# EAGLE schematic OOBD-TigerV2_old (EAGLE 7.2.0)

## Sheet 1 of 5
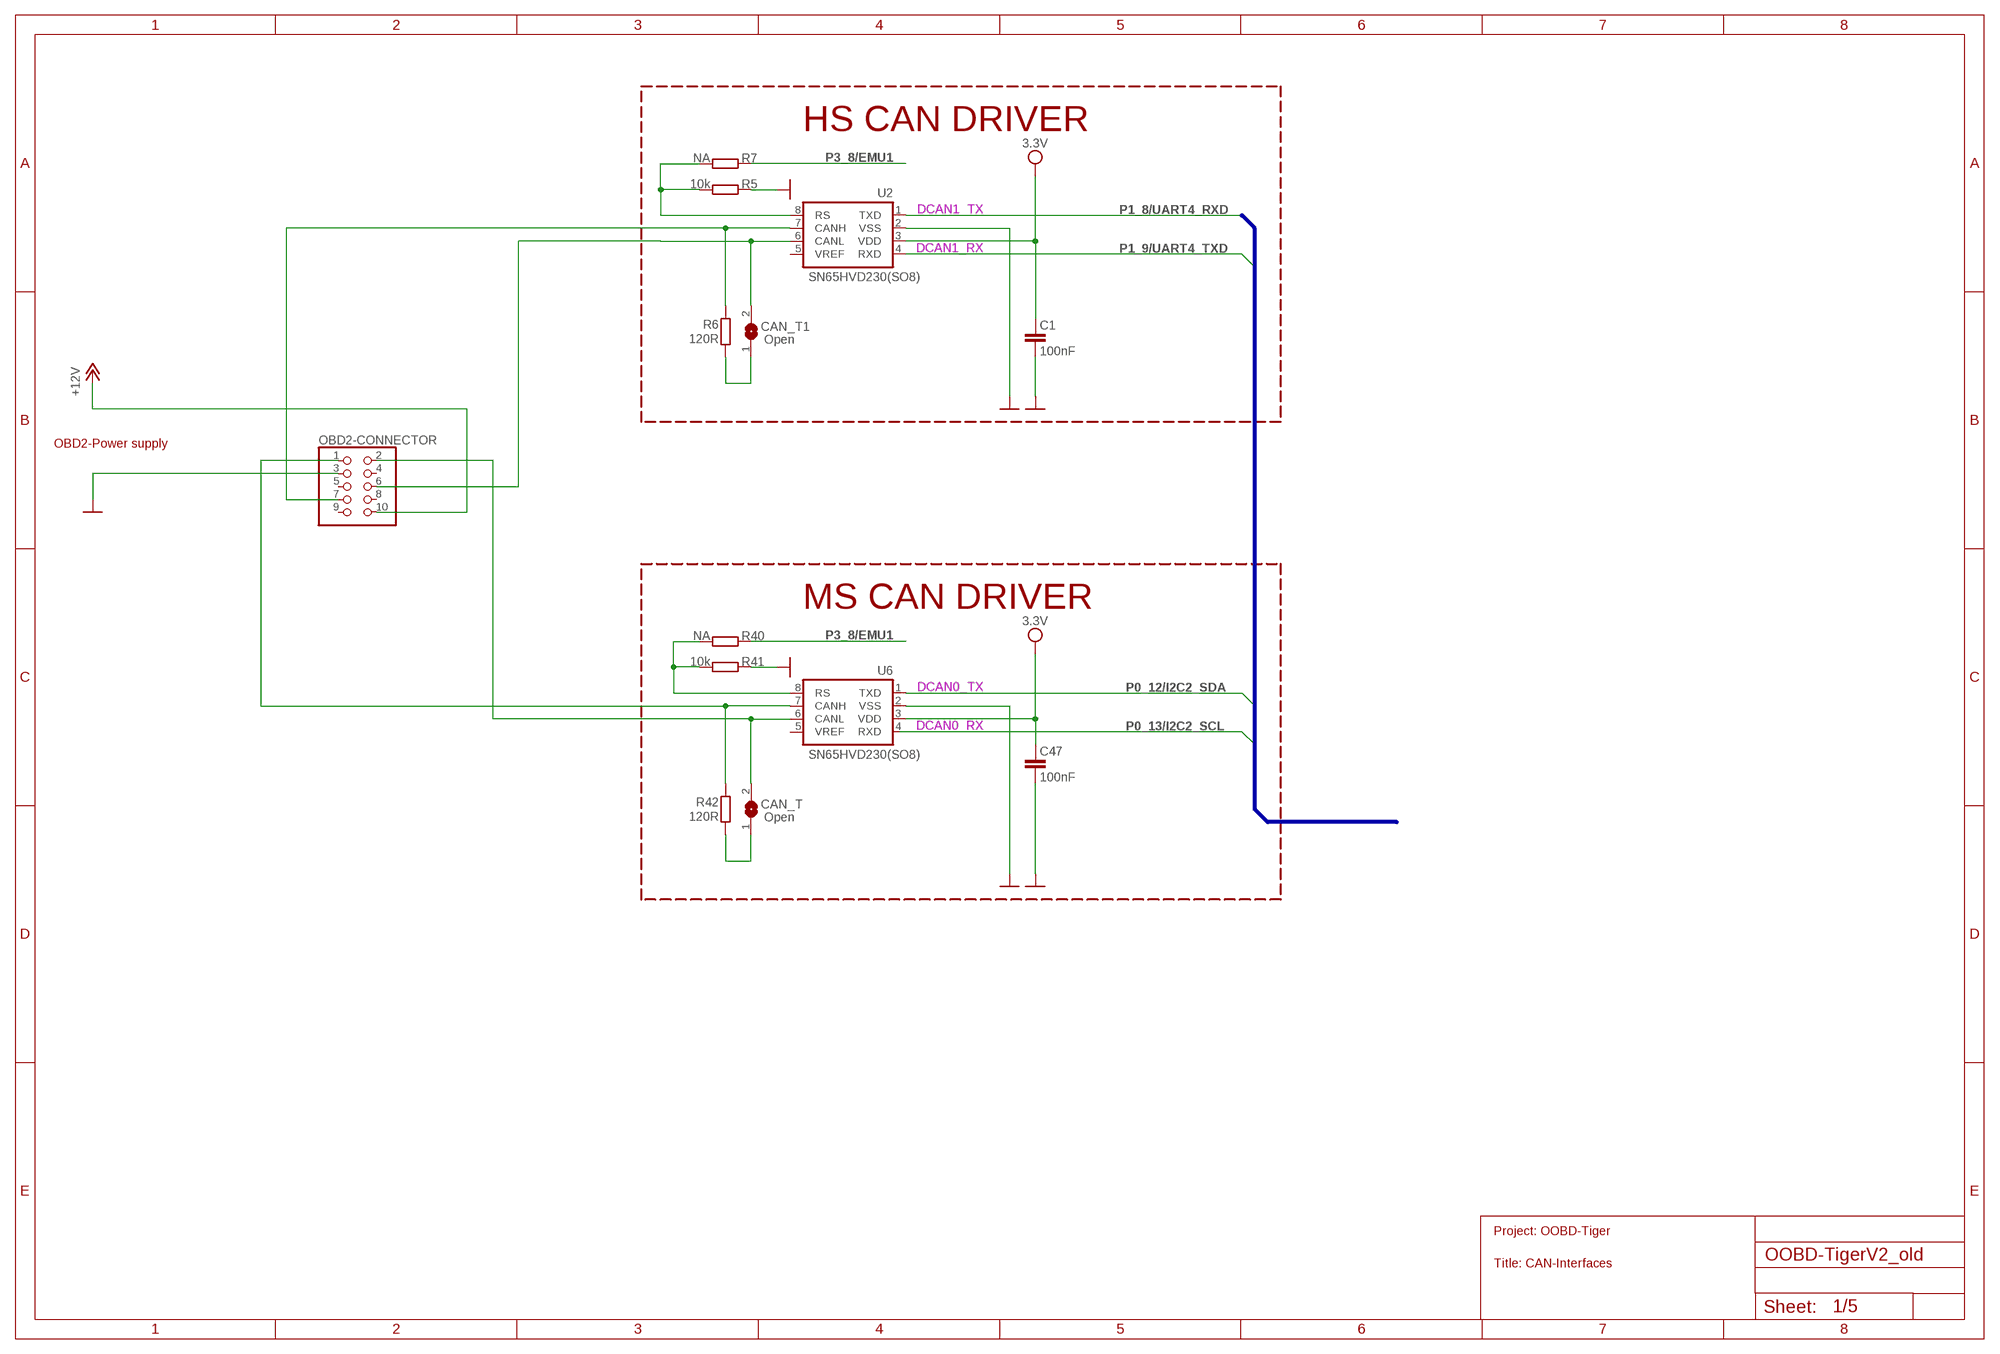
[diagram p0: schematic, sheet 1]

### Parts
C1  100nF  C-EUC0603_DWS  [C0603_DWS]
C47  100nF  C-EUC0603_DWS  [C0603_DWS]
CAN_T  Open  SJSJ_SMALLER  [SJ_1_SMALLER]
CAN_T1  Open  SJSJ_SMALLER  [SJ_1_SMALLER]
OBD2-CONNECTOR  PINHD-2X5/90  [2X05/90]
R5  10k  R-EU_R0603_5MIL_DWS  [R0603_5MIL_DWS]
R6  120R  R-EU_R1206_5MIL_WS  [R1206_5MIL_WS]
R7  NA  R-EU_R0603_5MIL_DWS  [R0603_5MIL_DWS]
R40  NA  R-EU_R0603_5MIL_DWS  [R0603_5MIL_DWS]
R41  10k  R-EU_R0603_5MIL_DWS  [R0603_5MIL_DWS]
R42  120R  R-EU_R1206_5MIL_WS  [R1206_5MIL_WS]
U2  SN65HVD230(SO8)  MCP2551  [SO-08]
U6  SN65HVD230(SO8)  MCP2551  [SO-08]

### Nets
+12V: OBD2-CONNECTOR.10 ; also sheet 5
CANH: OBD2-CONNECTOR.1 R42.2 U6.7(CANH)
CANH1: OBD2-CONNECTOR.7 R6.2 U2.7(CANH)
CANL: CAN_T.2 OBD2-CONNECTOR.2 U6.6(CANL)
CANL1: CAN_T1.2 OBD2-CONNECTOR.6 U2.6(CANL)
GND [PWR]: C1.2 C47.2 OBD2-CONNECTOR.3 R5.2 R41.2 U2.2(VSS) U6.2(VSS) ; also sheet 2,4,5
N$2: CAN_T1.1 R6.1
N$5: R5.1 R7.1 U2.8(RS)
N$80: R40.1 R41.1 U6.8(RS)
N$566: CAN_T.1 R42.1
P0_12/I2C2_SDA: U6.1(TXD) ; also sheet 4
P0_13/I2C2_SCL: U6.4(RXD) ; also sheet 4
P1_8/UART4_RXD: U2.1(TXD) ; also sheet 4
P1_9/UART4_TXD: U2.4(RXD) ; also sheet 4
P3_8/EMU1: R7.2 R40.2 ; also sheet 4
VCC [PWR]: C1.1 C47.1 U2.3(VDD) U6.3(VDD) ; supply symbol labelled 3.3V ; also sheet 4,5
Unconnected: OBD2-CONNECTOR.4 OBD2-CONNECTOR.5 OBD2-CONNECTOR.8 OBD2-CONNECTOR.9 U2.5(VREF) U6.5(VREF)

### Buses
B$2

### Notes on the sheet
- HS CAN DRIVER
- DCAN1_TX
- DCAN1_RX
- OBD2-Power supply
- MS CAN DRIVER
- DCAN0_TX
- DCAN0_RX
- Project: OOBD-Tiger
- Title: CAN-Interfaces

## Sheet 2 of 5
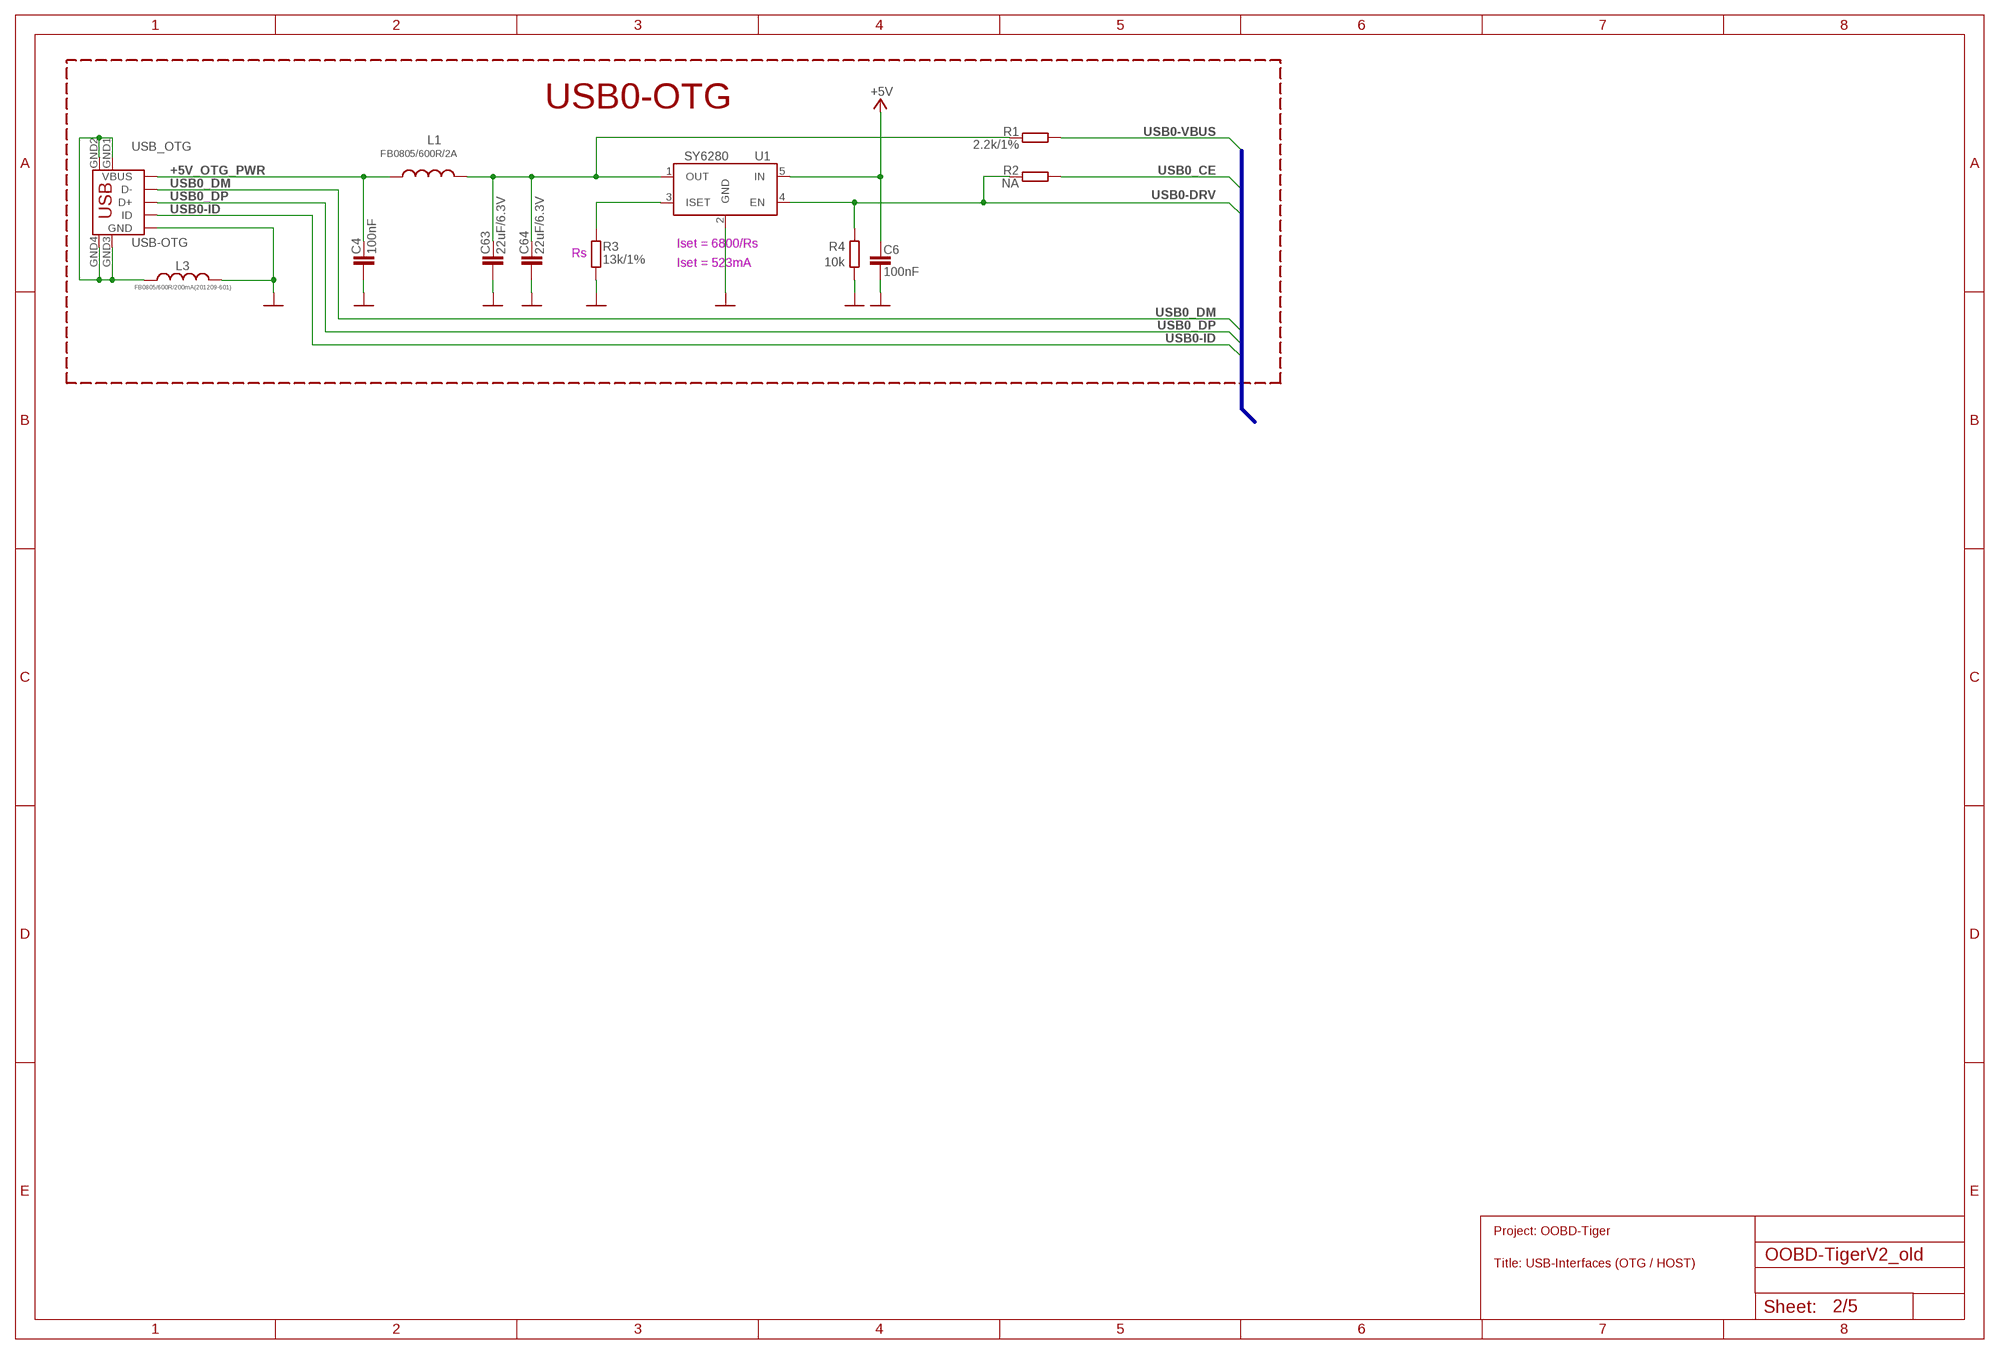
[diagram p1: schematic, sheet 2]

### Parts
C4  100nF  C-EUC0603_DWS  [C0603_DWS]
C6  100nF  C-EUC0603_DWS  [C0603_DWS]
C63  22uF/6.3V  C-EUC0603_DWS  [C0603_DWS]
C64  22uF/6.3V  C-EUC0603_DWS  [C0603_DWS]
L1  FB0805/600R/2A  L-USL0805_5MIL_DWS  [L0805_5MIL_DWS]
L3  FB0805/600R/200mA(201209-601)  L-USL0805_5MIL_DWS  [L0805_5MIL_DWS]
R1  2.2k/1%  R-EU_R0603_5MIL_DWS  [R0603_5MIL_DWS]
R2  NA  R-EU_R0603_5MIL_DWS  [R0603_5MIL_DWS]
R3  13k/1%  R-EU_R0603_5MIL_DWS  [R0603_5MIL_DWS]
R4  10k  R-EU_R0603_5MIL_DWS  [R0603_5MIL_DWS]
U1  SY6280  [SOT23-5]
USB_OTG  USB-OTG  MINI_USB9  [USB_MINI_9PIN]

### Nets
+5V: C6.1 U1.5(IN) ; also sheet 3,4,5
+5V_OTG_PWR: C4.1 L1.1 USB_OTG.VBUS
GND [PWR]: C4.2 C6.2 C63.2 C64.2 L3.1 R3.1 R4.1 U1.2(GND) USB_OTG.GND ; also sheet 1,4,5
N$99: R3.2 U1.3(ISET)
N$100: C63.1 C64.1 L1.2 R1.2 U1.1(OUT)
N$266: L3.2 USB_OTG.GND1 USB_OTG.GND2 USB_OTG.GND3 USB_OTG.GND4
USB0-DRV: R2.1 R4.2 U1.4(EN) ; also sheet 4
USB0-ID: USB_OTG.ID ; also sheet 4
USB0-VBUS: R1.1 ; also sheet 4
USB0_CE: R2.2 ; also sheet 4
USB0_DM: USB_OTG.D- ; also sheet 4
USB0_DP: USB_OTG.D+ ; also sheet 4

### Buses
USB0_DM,USB0_DP,USB0-ID,USB0-VBUS,USB0-DRV,USB0_CE,USB1_DM,USB1_DP,USB1_ID,USB1_DRV,USB1_CE

### Notes on the sheet
- USB0-OTG
- Iset = 6800/Rs
- Rs
- Iset = 523mA
- Project: OOBD-Tiger
- Title: USB-Interfaces (OTG / HOST)

## Sheet 3 of 5
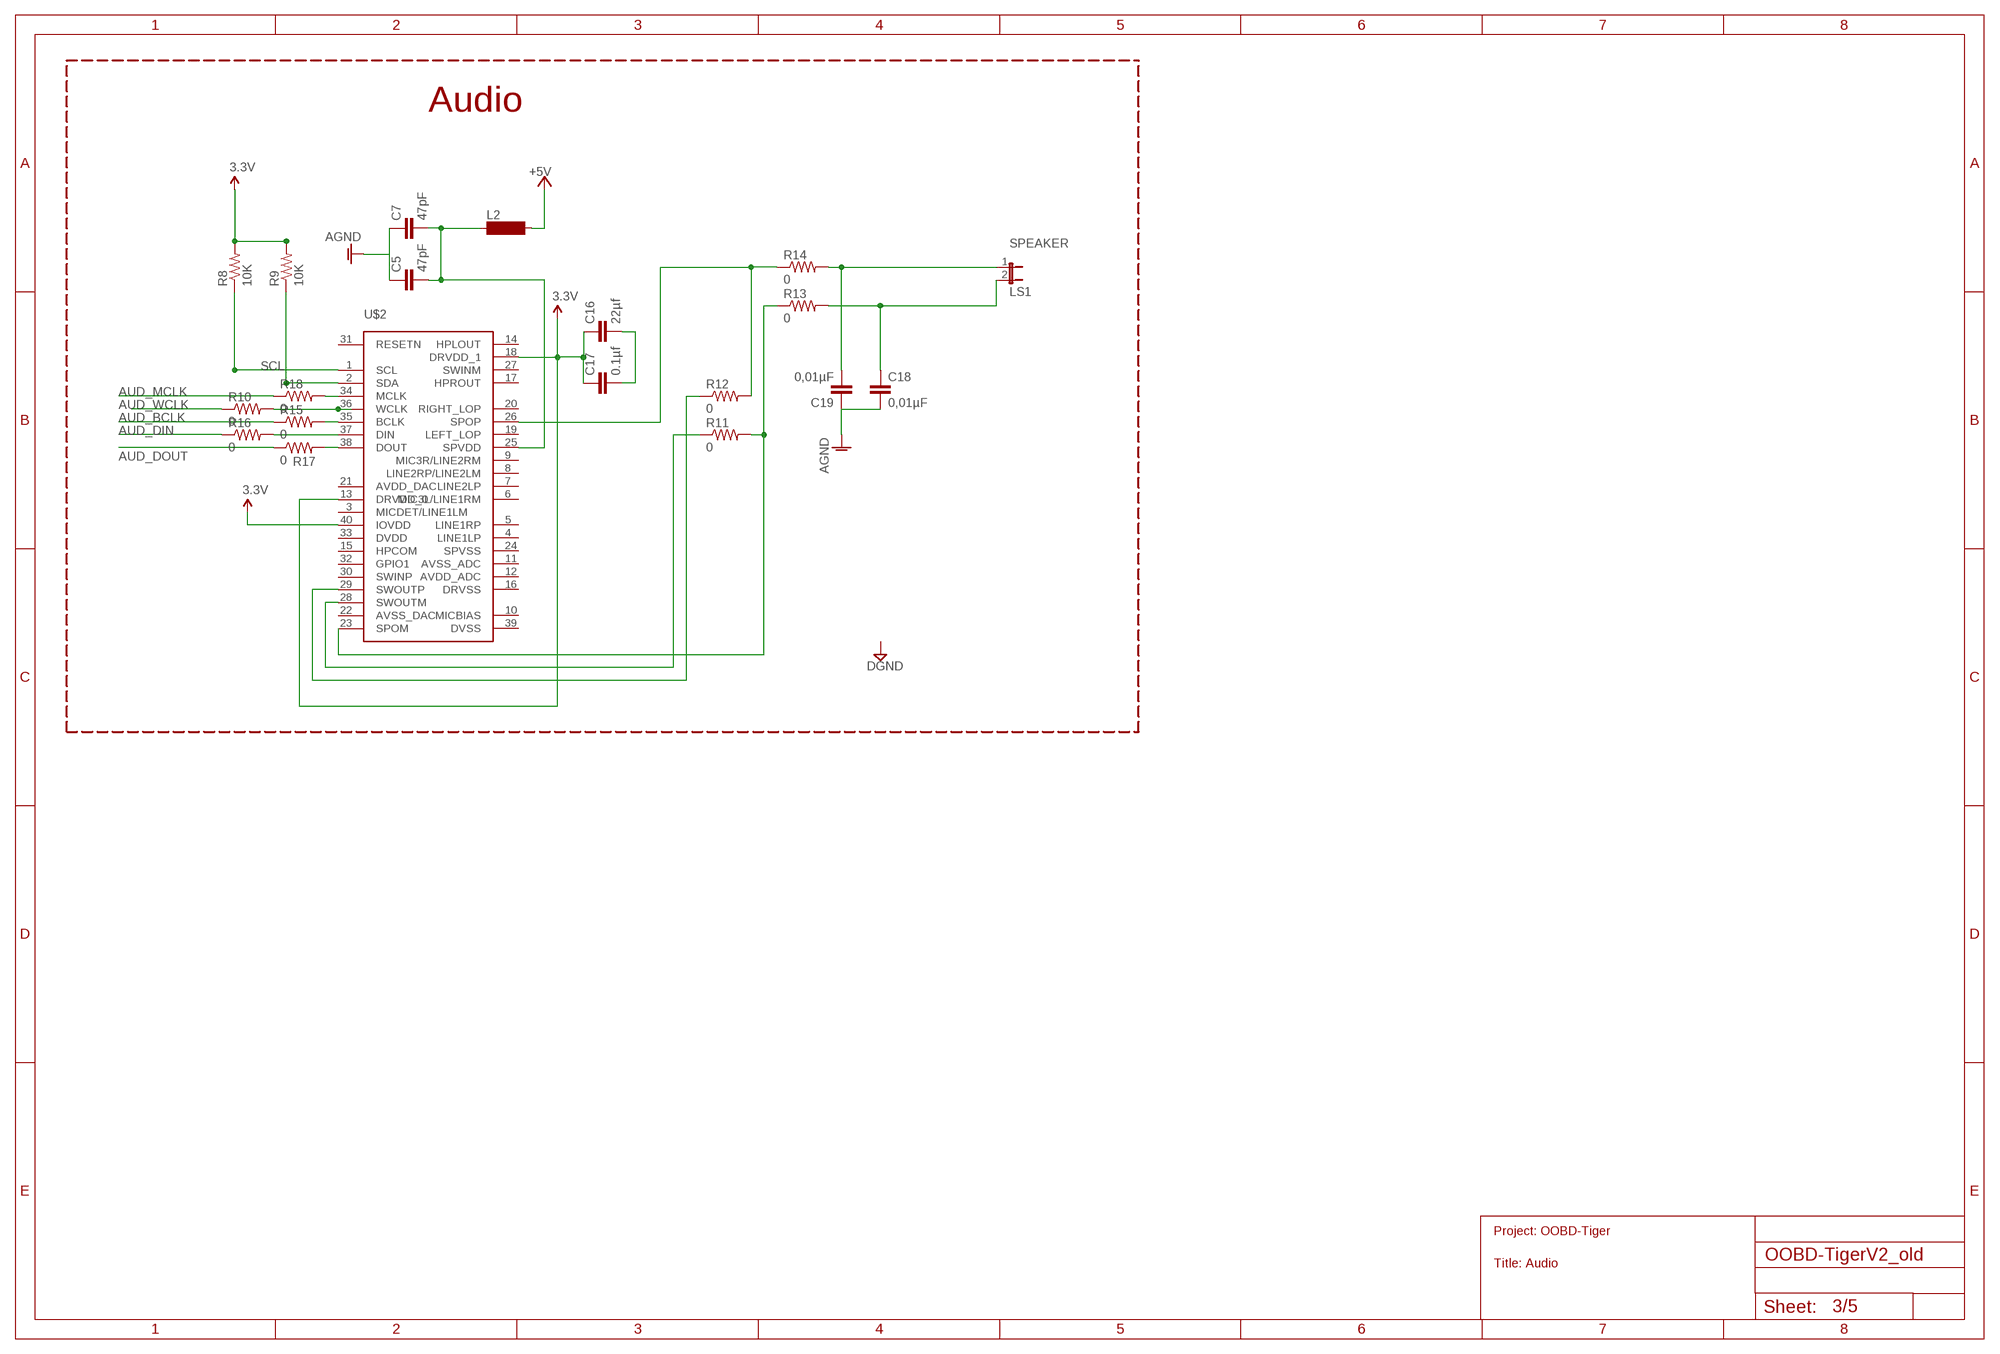
[diagram p2: schematic, sheet 3]

### Parts
C5  47pF  CAP0402-CAP  [0402-CAP]
C7  47pF  CAP0402-CAP  [0402-CAP]
C16  22µf  CAP0402-CAP  [0402-CAP]
C17  0.1µf  CAP0402-CAP  [0402-CAP]
C18  0,01µF  CAP0402-CAP  [0402-CAP]
C19  0,01µF  CAP0402-CAP  [0402-CAP]
L2  SM-L15B  [SM-L15B]
R8  10K  RESISTOR0402-RES  [0402-RES]
R9  10K  RESISTOR0402-RES  [0402-RES]
R10  0  RESISTOR0805-RES  [0805]
R11  0  RESISTOR0805-RES  [0805]
R12  0  RESISTOR0805-RES  [0805]
R13  0  RESISTOR0805-RES  [0805]
R14  0  RESISTOR0805-RES  [0805]
R15  0  RESISTOR0805-RES  [0805]
R16  0  RESISTOR0805-RES  [0805]
R17  0  RESISTOR0805-RES  [0805]
R18  0  RESISTOR0805-RES  [0805]
SPEAKER  LS1  JUMPER-2PTH  [1X02]
U$2  TLV320AIC3107  [QFN40-6X6]

### Nets
3.3V: C16.1 C17.1 R8.2 R9.2 U$2.13(DRVDD_0) U$2.18(DRVDD_1) U$2.40(IOVDD)
+5V: L2.2 ; also sheet 2,4,5
AGND: C5.1 C7.1 C18.2 C19.1
AUD_BCLK: R15.1
AUD_DIN: R16.1
AUD_DOUT: R17.1
AUD_MCLK: R18.1
AUD_WCLK: R10.1
N$10: R9.1 U$2.2(SDA)
N$14: C19.2 R14.2 SPEAKER.1
N$15: C18.1 R13.2 SPEAKER.2
N$16: C16.2 C17.2
N$17: C5.2 C7.2 L2.1 U$2.25(SPVDD)
N$18: R11.2 R13.1 U$2.23(SPOM)
N$19: R11.1 U$2.28(SWOUTM)
N$20: R12.1 U$2.29(SWOUTP)
N$21: R12.2 R14.1 U$2.26(SPOP)
N$22: R17.2 U$2.38(DOUT)
N$23: R16.2 U$2.37(DIN)
N$24: R15.2 U$2.35(BCLK)
N$25: R10.2 U$2.36(WCLK)
N$26: R18.2 U$2.34(MCLK)
SCL: R8.1 U$2.1(SCL)
Unconnected: U$2.3(MICDET/LINE1LM) U$2.4(LINE1LP) U$2.5(LINE1RP) U$2.6(MIC3L/LINE1RM) U$2.7(LINE2LP) U$2.8(LINE2RP/LINE2LM) U$2.9(MIC3R/LINE2RM) U$2.10(MICBIAS) U$2.11(AVSS_ADC) U$2.12(AVDD_ADC) U$2.14(HPLOUT) U$2.15(HPCOM) U$2.16(DRVSS) U$2.17(HPROUT) U$2.19(LEFT_LOP) U$2.20(RIGHT_LOP) U$2.21(AVDD_DAC) U$2.22(AVSS_DAC) U$2.24(SPVSS) U$2.27(SWINM) U$2.30(SWINP) U$2.31(RESETN) U$2.32(GPIO1) U$2.33(DVDD) U$2.39(DVSS)

### Notes on the sheet
- Audio
- Project: OOBD-Tiger
- Title: Audio

## Sheet 4 of 5
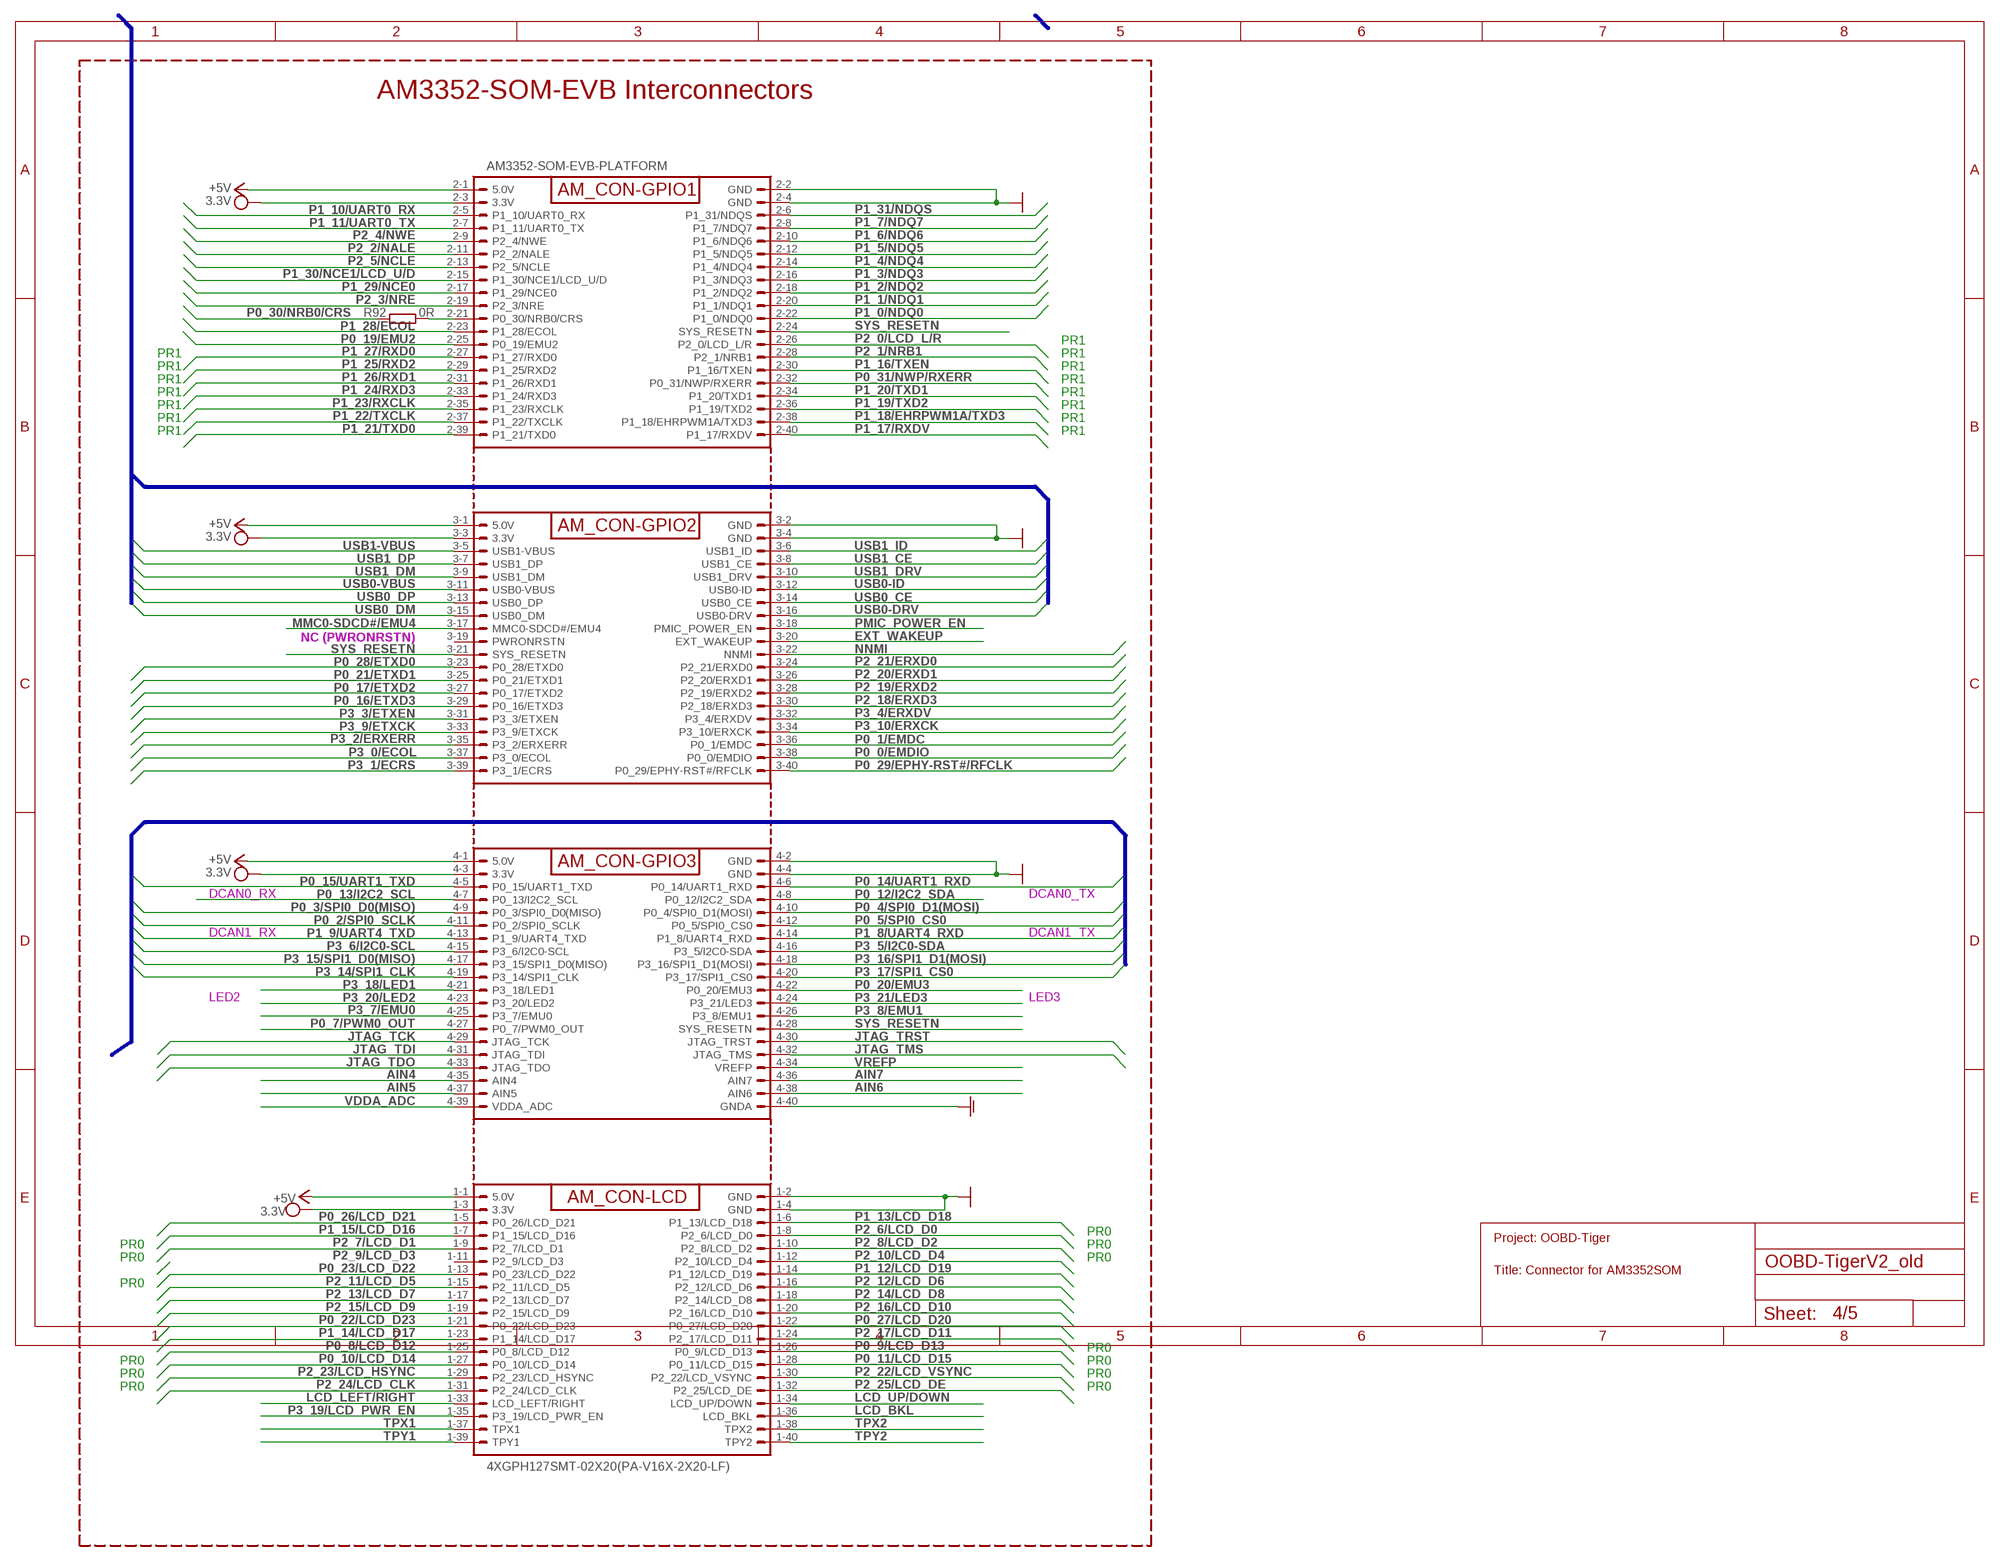
[diagram p3: schematic, sheet 4]

### Parts
AM3352-SOM-EVB-PLATFORM  4XGPH127SMT-02X20(PA-V16X-2X20-LF)  AM3352-SOM-EVB---4XGPH127SMT-02X20(PA-V16X-2X20-LF)  [AM3352-SOM-EVB]
R92  0R  R-EU_R0603_5MIL_DWS  [R0603_5MIL_DWS]

### Nets
+5V: AM3352-SOM-EVB-PLATFORM.1-1(5.0V) AM3352-SOM-EVB-PLATFORM.2-1(5.0V) AM3352-SOM-EVB-PLATFORM.3-1(5.0V) AM3352-SOM-EVB-PLATFORM.4-1(5.0V) ; also sheet 2,3,5
AIN4: AM3352-SOM-EVB-PLATFORM.4-35(AIN4)
AIN5: AM3352-SOM-EVB-PLATFORM.4-37(AIN5)
AIN6: AM3352-SOM-EVB-PLATFORM.4-38(AIN6)
AIN7: AM3352-SOM-EVB-PLATFORM.4-36(AIN7)
EXT_WAKEUP: AM3352-SOM-EVB-PLATFORM.3-20(EXT_WAKEUP) ; also sheet 5
GND [PWR]: AM3352-SOM-EVB-PLATFORM.1-2(GND) AM3352-SOM-EVB-PLATFORM.1-4(GND) AM3352-SOM-EVB-PLATFORM.2-2(GND) AM3352-SOM-EVB-PLATFORM.2-4(GND) AM3352-SOM-EVB-PLATFORM.3-2(GND) AM3352-SOM-EVB-PLATFORM.3-4(GND) AM3352-SOM-EVB-PLATFORM.4-2(GND) AM3352-SOM-EVB-PLATFORM.4-4(GND) ; also sheet 1,2,5
GNDA: AM3352-SOM-EVB-PLATFORM.4-40(GNDA)
JTAG_TCK: AM3352-SOM-EVB-PLATFORM.4-29(JTAG_TCK)
JTAG_TDI: AM3352-SOM-EVB-PLATFORM.4-31(JTAG_TDI)
JTAG_TDO: AM3352-SOM-EVB-PLATFORM.4-33(JTAG_TDO)
JTAG_TMS: AM3352-SOM-EVB-PLATFORM.4-32(JTAG_TMS)
JTAG_TRST: AM3352-SOM-EVB-PLATFORM.4-30(JTAG_TRST)
LCD_BKL: AM3352-SOM-EVB-PLATFORM.1-36(LCD_BKL)
LCD_LEFT/RIGHT: AM3352-SOM-EVB-PLATFORM.1-33(LCD_LEFT/RIGHT)
LCD_UP/DOWN: AM3352-SOM-EVB-PLATFORM.1-34(LCD_UP/DOWN)
MMC0-SDCD#/EMU4: AM3352-SOM-EVB-PLATFORM.3-17(MMC0-SDCD#/EMU4)
N$13: AM3352-SOM-EVB-PLATFORM.2-21(P0_30/NRB0/CRS) R92.2
NNMI: AM3352-SOM-EVB-PLATFORM.3-22(NNMI)
P0_0/EMDIO: AM3352-SOM-EVB-PLATFORM.3-38(P0_0/EMDIO)
P0_1/EMDC: AM3352-SOM-EVB-PLATFORM.3-36(P0_1/EMDC)
P0_2/SPI0_SCLK: AM3352-SOM-EVB-PLATFORM.4-11(P0_2/SPI0_SCLK)
P0_3/SPI0_D0(MISO): AM3352-SOM-EVB-PLATFORM.4-9(P0_3/SPI0_D0(MISO))
P0_4/SPI0_D1(MOSI): AM3352-SOM-EVB-PLATFORM.4-10(P0_4/SPI0_D1(MOSI))
P0_5/SPI0_CS0: AM3352-SOM-EVB-PLATFORM.4-12(P0_5/SPI0_CS0)
P0_7/PWM0_OUT: AM3352-SOM-EVB-PLATFORM.4-27(P0_7/PWM0_OUT)
P0_8/LCD_D12: AM3352-SOM-EVB-PLATFORM.1-25(P0_8/LCD_D12)
P0_9/LCD_D13: AM3352-SOM-EVB-PLATFORM.1-26(P0_9/LCD_D13)
P0_10/LCD_D14: AM3352-SOM-EVB-PLATFORM.1-27(P0_10/LCD_D14)
P0_11/LCD_D15: AM3352-SOM-EVB-PLATFORM.1-28(P0_11/LCD_D15)
P0_12/I2C2_SDA: AM3352-SOM-EVB-PLATFORM.4-8(P0_12/I2C2_SDA) ; also sheet 1
P0_13/I2C2_SCL: AM3352-SOM-EVB-PLATFORM.4-7(P0_13/I2C2_SCL) ; also sheet 1
P0_14/UART1_RXD: AM3352-SOM-EVB-PLATFORM.4-6(P0_14/UART1_RXD)
P0_15/UART1_TXD: AM3352-SOM-EVB-PLATFORM.4-5(P0_15/UART1_TXD)
P0_16/ETXD3: AM3352-SOM-EVB-PLATFORM.3-29(P0_16/ETXD3)
P0_17/ETXD2: AM3352-SOM-EVB-PLATFORM.3-27(P0_17/ETXD2)
P0_19/EMU2: AM3352-SOM-EVB-PLATFORM.2-25(P0_19/EMU2)
P0_20/EMU3: AM3352-SOM-EVB-PLATFORM.4-22(P0_20/EMU3)
P0_21/ETXD1: AM3352-SOM-EVB-PLATFORM.3-25(P0_21/ETXD1)
P0_22/LCD_D23: AM3352-SOM-EVB-PLATFORM.1-21(P0_22/LCD_D23)
P0_23/LCD_D22: AM3352-SOM-EVB-PLATFORM.1-13(P0_23/LCD_D22)
P0_26/LCD_D21: AM3352-SOM-EVB-PLATFORM.1-5(P0_26/LCD_D21)
P0_27/LCD_D20: AM3352-SOM-EVB-PLATFORM.1-22(P0_27/LCD_D20)
P0_28/ETXD0: AM3352-SOM-EVB-PLATFORM.3-23(P0_28/ETXD0)
P0_29/EPHY-RST#/RFCLK: AM3352-SOM-EVB-PLATFORM.3-40(P0_29/EPHY-RST#/RFCLK)
P0_30/NRB0/CRS: R92.1
P0_31/NWP/RXERR: AM3352-SOM-EVB-PLATFORM.2-32(P0_31/NWP/RXERR)
P1_0/NDQ0: AM3352-SOM-EVB-PLATFORM.2-22(P1_0/NDQ0)
P1_1/NDQ1: AM3352-SOM-EVB-PLATFORM.2-20(P1_1/NDQ1)
P1_2/NDQ2: AM3352-SOM-EVB-PLATFORM.2-18(P1_2/NDQ2)
P1_3/NDQ3: AM3352-SOM-EVB-PLATFORM.2-16(P1_3/NDQ3)
P1_4/NDQ4: AM3352-SOM-EVB-PLATFORM.2-14(P1_4/NDQ4)
P1_5/NDQ5: AM3352-SOM-EVB-PLATFORM.2-12(P1_5/NDQ5)
P1_6/NDQ6: AM3352-SOM-EVB-PLATFORM.2-10(P1_6/NDQ6)
P1_7/NDQ7: AM3352-SOM-EVB-PLATFORM.2-8(P1_7/NDQ7)
P1_8/UART4_RXD: AM3352-SOM-EVB-PLATFORM.4-14(P1_8/UART4_RXD) ; also sheet 1
P1_9/UART4_TXD: AM3352-SOM-EVB-PLATFORM.4-13(P1_9/UART4_TXD) ; also sheet 1
P1_10/UART0_RX: AM3352-SOM-EVB-PLATFORM.2-5(P1_10/UART0_RX)
P1_11/UART0_TX: AM3352-SOM-EVB-PLATFORM.2-7(P1_11/UART0_TX)
P1_12/LCD_D19: AM3352-SOM-EVB-PLATFORM.1-14(P1_12/LCD_D19)
P1_13/LCD_D18: AM3352-SOM-EVB-PLATFORM.1-6(P1_13/LCD_D18)
P1_14/LCD_D17: AM3352-SOM-EVB-PLATFORM.1-23(P1_14/LCD_D17)
P1_15/LCD_D16: AM3352-SOM-EVB-PLATFORM.1-7(P1_15/LCD_D16)
P1_16/TXEN: AM3352-SOM-EVB-PLATFORM.2-30(P1_16/TXEN)
P1_17/RXDV [PWR]: AM3352-SOM-EVB-PLATFORM.2-40(P1_17/RXDV)
P1_18/EHRPWM1A/TXD3: AM3352-SOM-EVB-PLATFORM.2-38(P1_18/EHRPWM1A/TXD3)
P1_19/TXD2: AM3352-SOM-EVB-PLATFORM.2-36(P1_19/TXD2)
P1_20/TXD1: AM3352-SOM-EVB-PLATFORM.2-34(P1_20/TXD1)
P1_21/TXD0: AM3352-SOM-EVB-PLATFORM.2-39(P1_21/TXD0)
P1_22/TXCLK: AM3352-SOM-EVB-PLATFORM.2-37(P1_22/TXCLK)
P1_23/RXCLK: AM3352-SOM-EVB-PLATFORM.2-35(P1_23/RXCLK)
P1_24/RXD3: AM3352-SOM-EVB-PLATFORM.2-33(P1_24/RXD3)
P1_25/RXD2: AM3352-SOM-EVB-PLATFORM.2-29(P1_25/RXD2)
P1_26/RXD1: AM3352-SOM-EVB-PLATFORM.2-31(P1_26/RXD1)
P1_27/RXD0: AM3352-SOM-EVB-PLATFORM.2-27(P1_27/RXD0)
P1_28/ECOL: AM3352-SOM-EVB-PLATFORM.2-23(P1_28/ECOL)
P1_29/NCE0: AM3352-SOM-EVB-PLATFORM.2-17(P1_29/NCE0)
P1_30/NCE1/LCD_U/D: AM3352-SOM-EVB-PLATFORM.2-15(P1_30/NCE1/LCD_U/D)
P1_31/NDQS: AM3352-SOM-EVB-PLATFORM.2-6(P1_31/NDQS)
P2_0/LCD_L/R: AM3352-SOM-EVB-PLATFORM.2-26(P2_0/LCD_L/R)
P2_1/NRB1: AM3352-SOM-EVB-PLATFORM.2-28(P2_1/NRB1)
P2_2/NALE: AM3352-SOM-EVB-PLATFORM.2-11(P2_2/NALE)
P2_3/NRE: AM3352-SOM-EVB-PLATFORM.2-19(P2_3/NRE)
P2_4/NWE: AM3352-SOM-EVB-PLATFORM.2-9(P2_4/NWE)
P2_5/NCLE: AM3352-SOM-EVB-PLATFORM.2-13(P2_5/NCLE)
P2_6/LCD_D0: AM3352-SOM-EVB-PLATFORM.1-8(P2_6/LCD_D0)
P2_7/LCD_D1: AM3352-SOM-EVB-PLATFORM.1-9(P2_7/LCD_D1)
P2_8/LCD_D2: AM3352-SOM-EVB-PLATFORM.1-10(P2_8/LCD_D2)
P2_10/LCD_D4: AM3352-SOM-EVB-PLATFORM.1-12(P2_10/LCD_D4)
P2_11/LCD_D5: AM3352-SOM-EVB-PLATFORM.1-15(P2_11/LCD_D5)
P2_12/LCD_D6: AM3352-SOM-EVB-PLATFORM.1-16(P2_12/LCD_D6)
P2_13/LCD_D7: AM3352-SOM-EVB-PLATFORM.1-17(P2_13/LCD_D7)
P2_14/LCD_D8: AM3352-SOM-EVB-PLATFORM.1-18(P2_14/LCD_D8)
P2_15/LCD_D9: AM3352-SOM-EVB-PLATFORM.1-19(P2_15/LCD_D9)
P2_16/LCD_D10: AM3352-SOM-EVB-PLATFORM.1-20(P2_16/LCD_D10)
P2_17/LCD_D11: AM3352-SOM-EVB-PLATFORM.1-24(P2_17/LCD_D11)
P2_18/ERXD3: AM3352-SOM-EVB-PLATFORM.3-30(P2_18/ERXD3)
P2_19/ERXD2: AM3352-SOM-EVB-PLATFORM.3-28(P2_19/ERXD2)
P2_20/ERXD1: AM3352-SOM-EVB-PLATFORM.3-26(P2_20/ERXD1)
P2_21/ERXD0: AM3352-SOM-EVB-PLATFORM.3-24(P2_21/ERXD0)
P2_22/LCD_VSYNC: AM3352-SOM-EVB-PLATFORM.1-30(P2_22/LCD_VSYNC)
P2_23/LCD_HSYNC: AM3352-SOM-EVB-PLATFORM.1-29(P2_23/LCD_HSYNC)
P2_24/LCD_CLK: AM3352-SOM-EVB-PLATFORM.1-31(P2_24/LCD_CLK)
P2_25/LCD_DE: AM3352-SOM-EVB-PLATFORM.1-32(P2_25/LCD_DE)
P3_0/ECOL: AM3352-SOM-EVB-PLATFORM.3-37(P3_0/ECOL)
P3_1/ECRS: AM3352-SOM-EVB-PLATFORM.3-39(P3_1/ECRS)
P3_2/ERXERR: AM3352-SOM-EVB-PLATFORM.3-35(P3_2/ERXERR)
P3_3/ETXEN: AM3352-SOM-EVB-PLATFORM.3-31(P3_3/ETXEN)
P3_4/ERXDV: AM3352-SOM-EVB-PLATFORM.3-32(P3_4/ERXDV)
P3_5/I2C0-SDA: AM3352-SOM-EVB-PLATFORM.4-16(P3_5/I2C0-SDA)
P3_6/I2C0-SCL: AM3352-SOM-EVB-PLATFORM.4-15(P3_6/I2C0-SCL)
P3_7/EMU0 [PWR]: AM3352-SOM-EVB-PLATFORM.4-25(P3_7/EMU0)
P3_8/EMU1: AM3352-SOM-EVB-PLATFORM.4-26(P3_8/EMU1) ; also sheet 1
P3_9/ETXCK: AM3352-SOM-EVB-PLATFORM.3-33(P3_9/ETXCK)
P3_10/ERXCK: AM3352-SOM-EVB-PLATFORM.3-34(P3_10/ERXCK)
P3_14/SPI1_CLK: AM3352-SOM-EVB-PLATFORM.4-19(P3_14/SPI1_CLK)
P3_15/SPI1_D0(MISO): AM3352-SOM-EVB-PLATFORM.4-17(P3_15/SPI1_D0(MISO))
P3_16/SPI1_D1(MOSI): AM3352-SOM-EVB-PLATFORM.4-18(P3_16/SPI1_D1(MOSI))
P3_17/SPI1_CS0: AM3352-SOM-EVB-PLATFORM.4-20(P3_17/SPI1_CS0)
P3_18/LED1: AM3352-SOM-EVB-PLATFORM.4-21(P3_18/LED1)
P3_19/LCD_PWR_EN: AM3352-SOM-EVB-PLATFORM.1-35(P3_19/LCD_PWR_EN)
P3_20/LED2: AM3352-SOM-EVB-PLATFORM.4-23(P3_20/LED2) ; also sheet 5
P3_21/LED3: AM3352-SOM-EVB-PLATFORM.4-24(P3_21/LED3) ; also sheet 5
PMIC_POWER_EN: AM3352-SOM-EVB-PLATFORM.3-18(PMIC_POWER_EN)
SYS_RESETN: AM3352-SOM-EVB-PLATFORM.2-24(SYS_RESETN) AM3352-SOM-EVB-PLATFORM.3-21(SYS_RESETN) AM3352-SOM-EVB-PLATFORM.4-28(SYS_RESETN)
TPX1: AM3352-SOM-EVB-PLATFORM.1-37(TPX1)
TPX2: AM3352-SOM-EVB-PLATFORM.1-38(TPX2)
TPY1: AM3352-SOM-EVB-PLATFORM.1-39(TPY1)
TPY2: AM3352-SOM-EVB-PLATFORM.1-40(TPY2)
USB0-DRV: AM3352-SOM-EVB-PLATFORM.3-16(USB0-DRV) ; also sheet 2
USB0-ID: AM3352-SOM-EVB-PLATFORM.3-12(USB0-ID) ; also sheet 2
USB0-VBUS: AM3352-SOM-EVB-PLATFORM.3-11(USB0-VBUS) ; also sheet 2
USB0_CE: AM3352-SOM-EVB-PLATFORM.3-14(USB0_CE) ; also sheet 2
USB0_DM: AM3352-SOM-EVB-PLATFORM.3-15(USB0_DM) ; also sheet 2
USB0_DP: AM3352-SOM-EVB-PLATFORM.3-13(USB0_DP) ; also sheet 2
USB1-VBUS: AM3352-SOM-EVB-PLATFORM.3-5(USB1-VBUS)
USB1_CE: AM3352-SOM-EVB-PLATFORM.3-8(USB1_CE)
USB1_DM: AM3352-SOM-EVB-PLATFORM.3-9(USB1_DM)
USB1_DP: AM3352-SOM-EVB-PLATFORM.3-7(USB1_DP)
USB1_DRV: AM3352-SOM-EVB-PLATFORM.3-10(USB1_DRV)
USB1_ID: AM3352-SOM-EVB-PLATFORM.3-6(USB1_ID)
VCC [PWR]: AM3352-SOM-EVB-PLATFORM.1-3(3.3V) AM3352-SOM-EVB-PLATFORM.2-3(3.3V) AM3352-SOM-EVB-PLATFORM.3-3(3.3V) AM3352-SOM-EVB-PLATFORM.4-3(3.3V) ; supply symbol labelled 3.3V ; also sheet 1,5
VDDA_ADC: AM3352-SOM-EVB-PLATFORM.4-39(VDDA_ADC)
VREFP: AM3352-SOM-EVB-PLATFORM.4-34(VREFP)
Unconnected: AM3352-SOM-EVB-PLATFORM.1-11(P2_9/LCD_D3) AM3352-SOM-EVB-PLATFORM.3-19(PWRONRSTN)

### Buses
USB0_DM,USB0_DP,USB0-ID,USB0-VBUS,USB0-DRV,USB0_CE,USB1_DM,USB1_DP,USB1_ID,USB1_DRV,USB1_CE
B$1
B$2

### Notes on the sheet
- AM3352-SOM-EVB Interconnectors
- PR1
- PR1 | PR1
- PR1 | PR1
- PR1 | PR1
- PR1 | PR1
- PR1 | PR1
- PR1 | PR1
- PR1 | PR1
- NC (PWRONRSTN)
- DCAN0_RX | DCAN0_TX
- DCAN1_RX | DCAN1_TX
- LED2 | LED3
- PR0
- Project: OOBD-Tiger
- PR0 | PR0
- PR0 | PR0
- Title: Connector for AM3352SOM
- PR0
- PR0
- PR0 | PR0
- PR0 | PR0
- PR0 | PR0

## Sheet 5 of 5
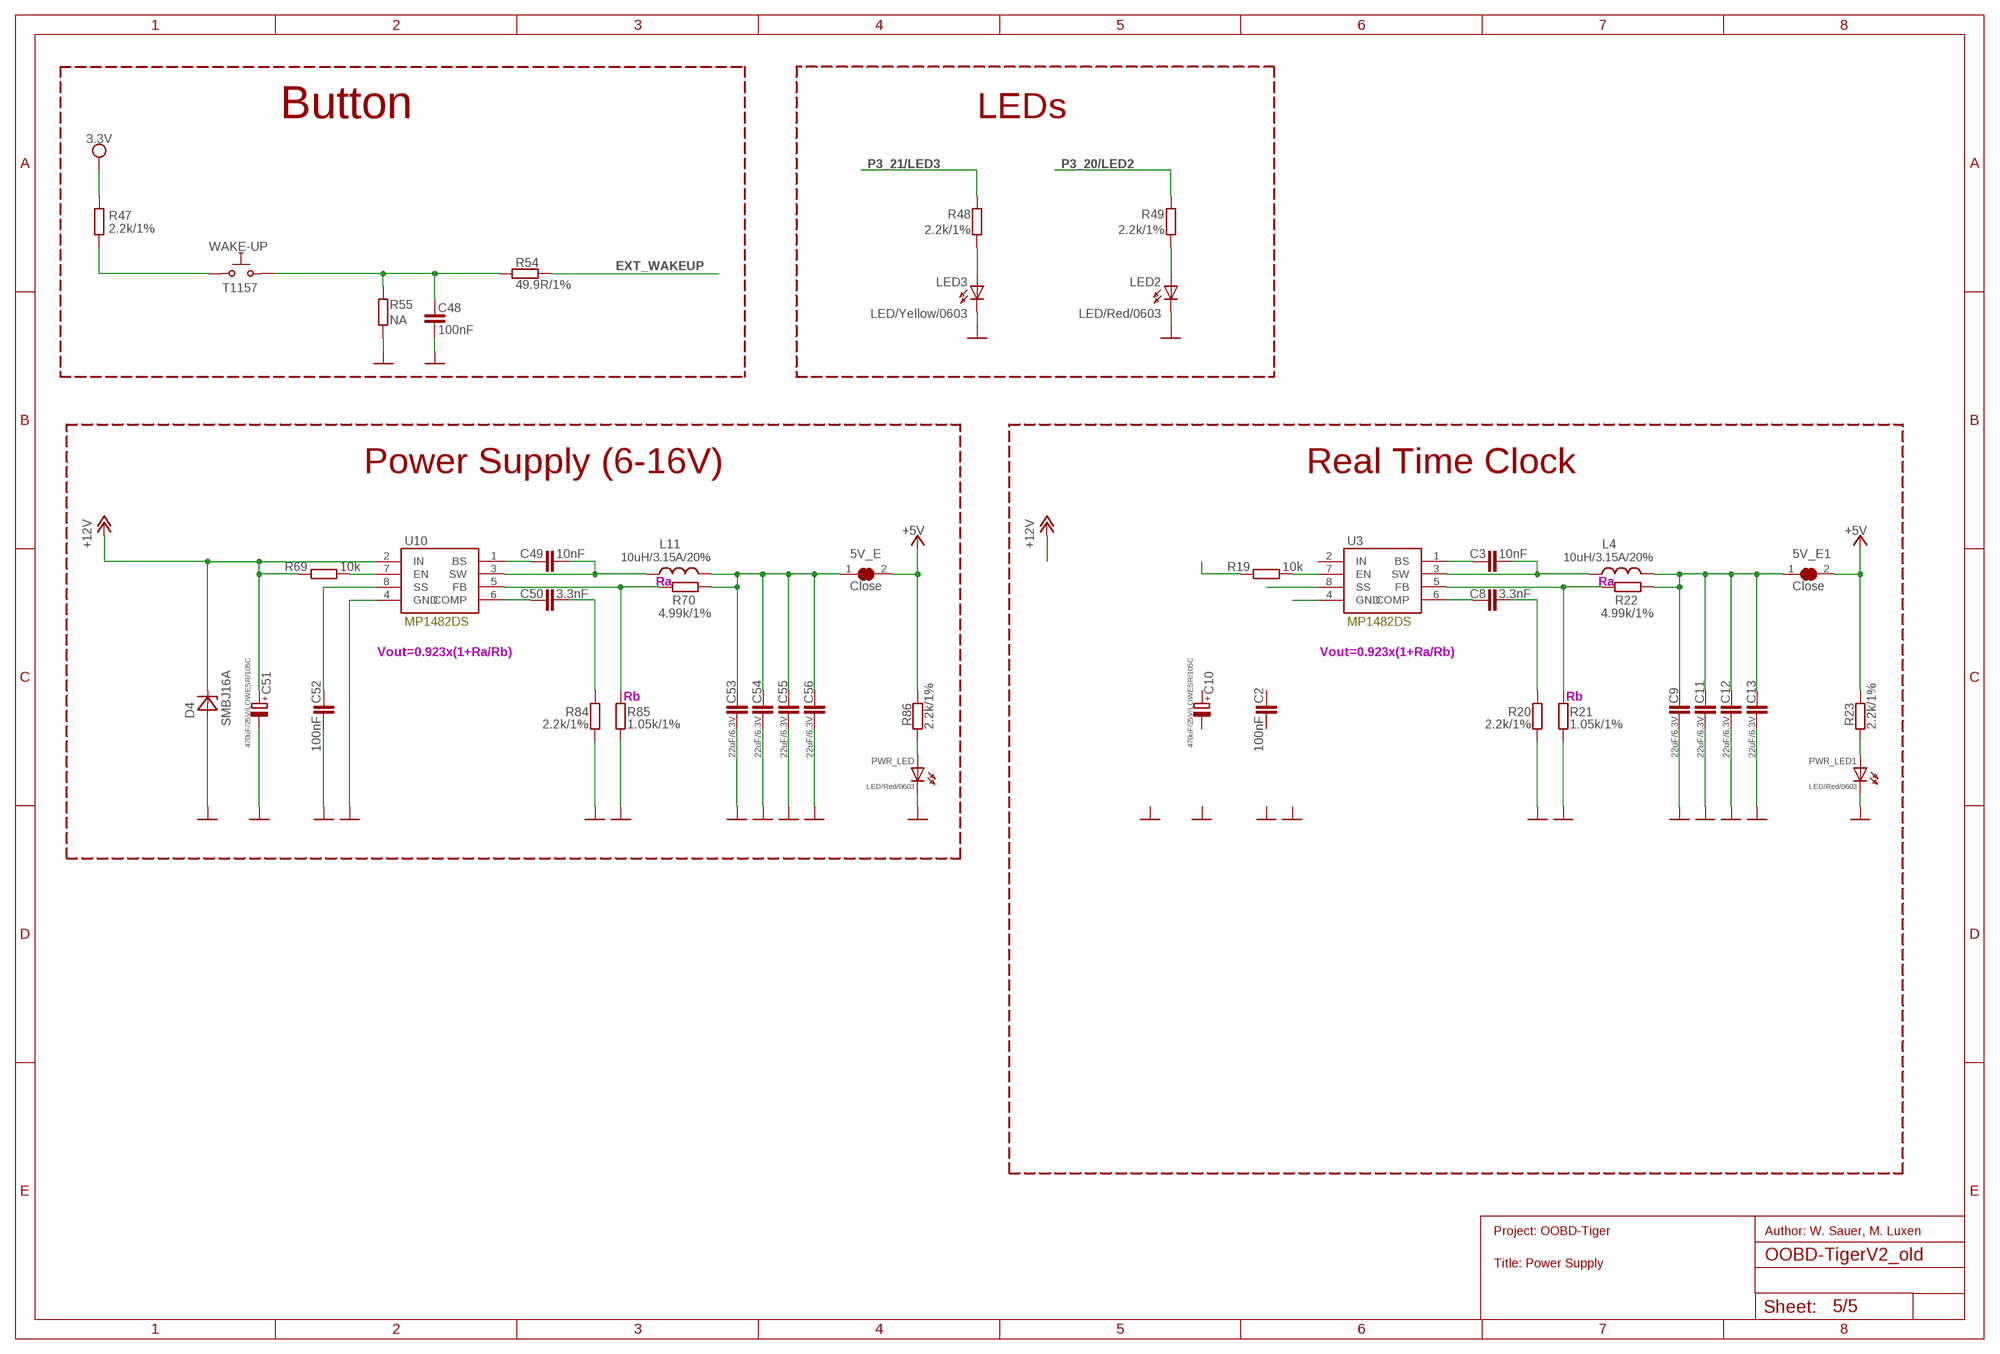
[diagram p4: schematic, sheet 5]

### Parts
5V_E  Close  SJSJ-CLOSE  [SJ-CLOSE]
5V_E1  Close  SJSJ-CLOSE  [SJ-CLOSE]
C2  100nF  C-EUC0603_DWS  [C0603_DWS]
C3  10nF  C-EUC0603_DWS  [C0603_DWS]
C8  3.3nF  C-EUC0603_DWS  [C0603_DWS]
C9  22uF/6.3V  C-EUC0603_DWS  [C0603_DWS]
C10  470uF/25V/LOWESR/105C  CPOL-EUE3.5-8  [E3,5-8]
C11  22uF/6.3V  C-EUC0603_DWS  [C0603_DWS]
C12  22uF/6.3V  C-EUC0603_DWS  [C0603_DWS]
C13  22uF/6.3V  C-EUC0603_DWS  [C0603_DWS]
C48  100nF  C-EUC0603_DWS  [C0603_DWS]
C49  10nF  C-EUC0603_DWS  [C0603_DWS]
C50  3.3nF  C-EUC0603_DWS  [C0603_DWS]
C51  470uF/25V/LOWESR/105C  CPOL-EUE3.5-8  [E3,5-8]
C52  100nF  C-EUC0603_DWS  [C0603_DWS]
C53  22uF/6.3V  C-EUC0603_DWS  [C0603_DWS]
C54  22uF/6.3V  C-EUC0603_DWS  [C0603_DWS]
C55  22uF/6.3V  C-EUC0603_DWS  [C0603_DWS]
C56  22uF/6.3V  C-EUC0603_DWS  [C0603_DWS]
D4  SMBJ16A  [DO214AA]
L4  10uH/3.15A/20%  LLQH88PN100M38  [8X8MM_3131]
L11  10uH/3.15A/20%  LLQH88PN100M38  [8X8MM_3131]
LED2  LED/Red/0603  LEDLED_0603  [LED_0603]
LED3  LED/Yellow/0603  LEDLED_0603  [LED_0603]
PWR_LED  LED/Red/0603  LED0603DWS  [LED-0603]
PWR_LED1  LED/Red/0603  LED0603DWS  [LED-0603]
R19  10k  R-EU_R0603_5MIL_DWS  [R0603_5MIL_DWS]
R20  2.2k/1%  R-EU_R0603_5MIL_DWS  [R0603_5MIL_DWS]
R21  1.05k/1%  R-EU_R0603_5MIL_DWS  [R0603_5MIL_DWS]
R22  4.99k/1%  R-EU_R0603_5MIL_DWS  [R0603_5MIL_DWS]
R23  2.2k/1%  R-EU_R0603_5MIL_DWS  [R0603_5MIL_DWS]
R47  2.2k/1%  R-EU_R0603_5MIL_DWS  [R0603_5MIL_DWS]
R48  2.2k/1%  R-EU_R0603_5MIL_DWS  [R0603_5MIL_DWS]
R49  2.2k/1%  R-EU_R0603_5MIL_DWS  [R0603_5MIL_DWS]
R54  49.9R/1%  R-EU_R0603_5MIL_DWS  [R0603_5MIL_DWS]
R55  NA  R-EU_R0603_5MIL_DWS  [R0603_5MIL_DWS]
R69  10k  R-EU_R0603_5MIL_DWS  [R0603_5MIL_DWS]
R70  4.99k/1%  R-EU_R0603_5MIL_DWS  [R0603_5MIL_DWS]
R84  2.2k/1%  R-EU_R0603_5MIL_DWS  [R0603_5MIL_DWS]
R85  1.05k/1%  R-EU_R0603_5MIL_DWS  [R0603_5MIL_DWS]
R86  2.2k/1%  R-EU_R0603_5MIL_DWS  [R0603_5MIL_DWS]
U3  MP1482DS  MP1482  [SOIC8]
U10  MP1482DS  MP1482  [SOIC8]
WAKE-UP  T1157  SW-TAKT""  [T1157]

### Nets
+5V: 5V_E1.2 5V_E.2 R23.1 R86.1 ; also sheet 2,3,4
+12V: C51.+ D4.C R69.1 U10.2(IN) ; also sheet 1
EXT_WAKEUP: R54.1 ; also sheet 4
GND [PWR]: C9.2 C11.2 C12.2 C13.2 C48.2 C51.- C52.2 C53.2 C54.2 C55.2 C56.2 D4.A LED2.C LED3.C PWR_LED1.C PWR_LED.C R20.2 R21.2 R55.2 R84.2 R85.2 U10.4(GND) ; also sheet 1,2,4
N$1: LED2.A R49.2
N$3: U3.8(SS)
N$4: C52.1 U10.8(SS)
N$6: R69.2 U10.7(EN)
N$7: C49.1 U10.1(BS)
N$8: C49.2 L11.1 U10.3(SW)
N$9: C50.1 U10.6(COMP)
N$11: C50.2 R84.1
N$12 [PWR]: 5V_E.1 C53.1 C54.1 C55.1 C56.1 L11.2 R70.2
N$27: R19.2 U3.7(EN)
N$28: C3.1 U3.1(BS)
N$29: C3.2 L4.1 U3.3(SW)
N$30: C8.1 U3.6(COMP)
N$31: C8.2 R20.1
N$32: R21.1 R22.1 U3.5(FB)
N$33: PWR_LED1.A R23.2
N$34 [PWR]: 5V_E1.1 C9.1 C11.1 C12.1 C13.1 L4.2 R22.2
N$35: R19.1
N$36 [PWR]: U3.4(GND)
N$43: R47.1 WAKE-UP.2
N$44: C48.1 R54.2 R55.1 WAKE-UP.1
N$62: R70.1 R85.1 U10.5(FB)
N$129: PWR_LED.A R86.2
N$231: LED3.A R48.2
P3_20/LED2: R49.1 ; also sheet 4
P3_21/LED3: R48.1 ; also sheet 4
VCC [PWR]: R47.2 ; supply symbol labelled 3.3V ; also sheet 1,4
Unconnected: C2.1 C2.2 C10.+ C10.- U3.2(IN)

### Notes on the sheet
- Button | LEDs
- Power Supply (6-16V) | Real Time Clock
- Ra | Ra
- Vout=0.923x(1+Ra/Rb) | Vout=0.923x(1+Ra/Rb)
- Rb | Rb
- Project: OOBD-Tiger | Author: W. Sauer, M. Luxen
- Title: Power Supply

## Library data of the parts
5V_E 5V_E1 CAN_T CAN_T1 = jumper:SJ: SMD solder JUMPER
AM3352-SOM-EVB-PLATFORM = OLIMEX_CASES:AM3352-SOM-EVB: AM3352-SOM-EVB-PLATFORM
C1-C4 C6 C8 C9 C11-C13 C47-C50 C52-C56 C63 C64 = rcl:C-EU: CAPACITOR, European symbol
C5 C7 C18 C19 = SparkFun-Passives:CAP: Capacitor Standard 0603 ceramic capacitor, and 0.1" leaded capacitor.; MANEX: 123-0001115
C10 C51 = rcl:CPOL-EU: POLARIZED CAPACITOR, European symbol
C16 C17 = SparkFun-Passives:CAP: Capacitor Standard 0603 ceramic capacitor, and 0.1" leaded capacitor.; MANEX: 123-0001032
D4 = OLIMEX_DISCRET:SMBJ16A
L1 L3 = rcl:L-US: INDUCTOR, American symbol
L2 = inductor-neosid:SM-L15: INDUCTOR SMD air coil with pick and place cap; OC_FARNELL: unknown; OC_NEWARK: unknown
L4 L11 = OLIMEX_DISCRET:L
LED2 LED3 PWR_LED PWR_LED1 = DOUBLE-SIDE:LED
OBD2-CONNECTOR = pinhead:PINHD-2X5: PIN HEADER
R1-R7 R19-R23 R40-R42 R47-R49 R54 R55 R69 R70 R84-R86 R92 = rcl:R-EU_: RESISTOR, European symbol
R8 R9 = SparkFun-Passives:RESISTOR: Resistor Basic schematic elements and footprints for 0603, 1206, and PTH resistors.; MANEX: 110-0002014
R10-R18 = SparkFun-Passives:RESISTOR: Resistor Basic schematic elements and footprints for 0603, 1206, and PTH resistors.
SPEAKER = SparkFun:JUMPER-2: Jumper Basic 0.1" spaced jumper. Use with breakaway headers.
U1 = OLIMEX_IC:SY6280
U2 U6 = arm:MCP2551
U3 U10 = OLIMEX_IC:MP1482
U$2 = TLV320AIC3107:TLV320AIC3107
USB_OTG = OLIMEX_CONNECTORS:MINI_USB9
WAKE-UP = gogo:SW-TAKT

## Net classes
2 lan_sh: clearance 0.762 mm